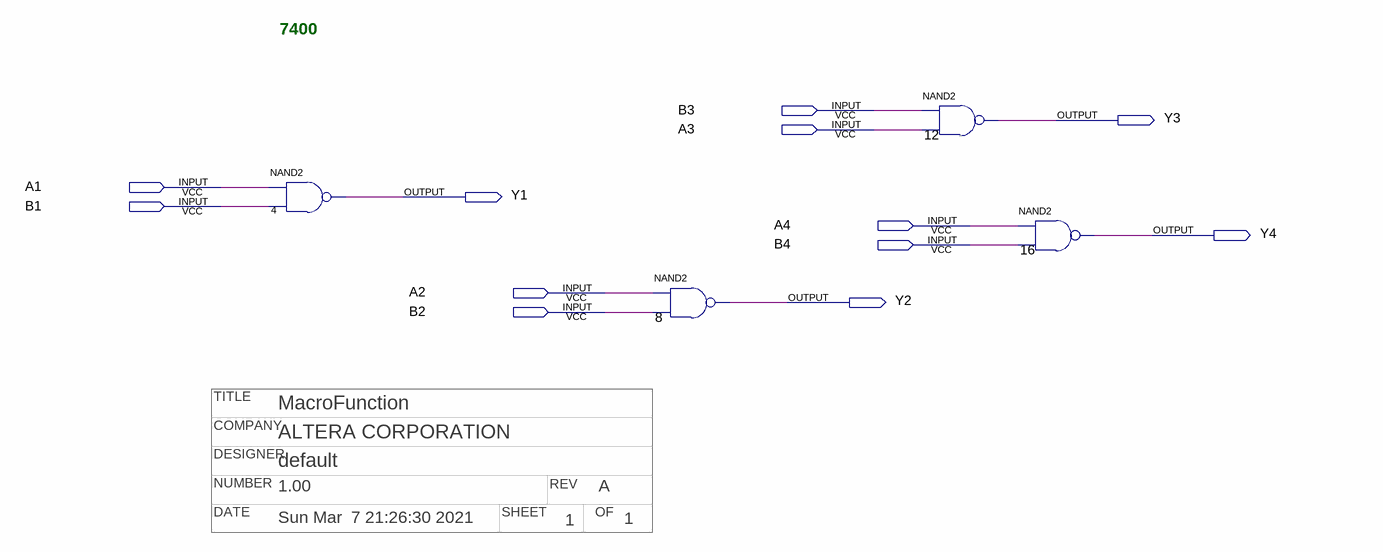
[diagram p0: schematic sheet]
// Quartus schematic nand4.bdf as structural Verilog: 4 symbols, 12 pins
// Title block: TITLE: MacroFunction; COMPANY: ALTERA CORPORATION; DESIGNER: default; NUMBER: 1.00; REV: A; DATE: Sun Mar  7 21:26:30 2021; SHEET: 1; OF: 1
module nand4 (
  input  B3,
  input  A3,
  input  A1,
  input  B1,
  input  A4,
  input  B4,
  input  A2,
  input  B2,
  output Y3,
  output Y1,
  output Y4,
  output Y2
);

  nand u_4 (Y1, A1, B1);
  nand u_8 (Y2, A2, B2);
  nand u_12 (Y3, B3, A3);
  nand u_16 (Y4, A4, B4);

  // Notes on the sheet:
  //   7400
endmodule
